# EAGLE design valiant_v1 (EAGLE 7.6.0)
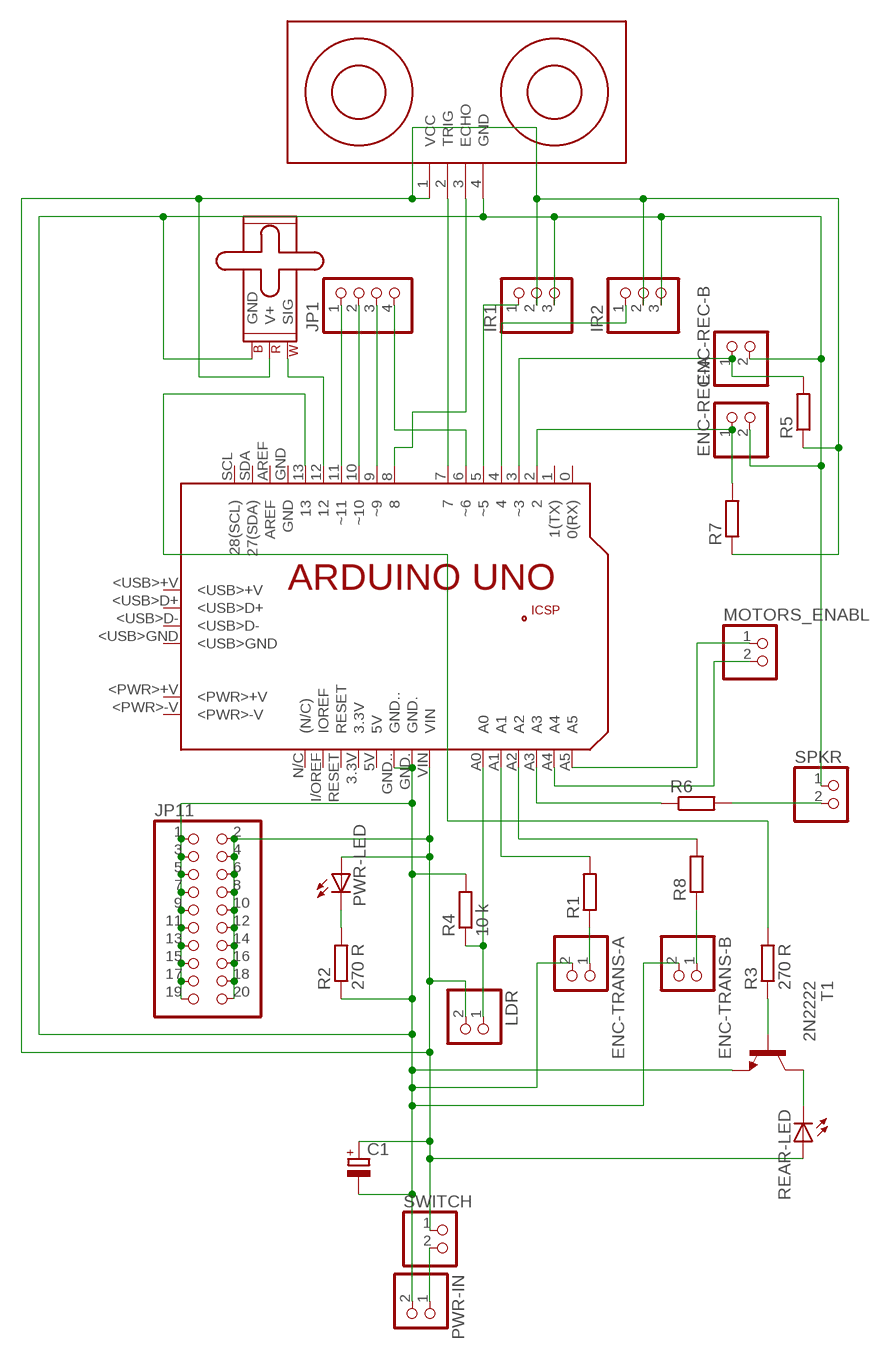
[diagram p0: schematic, sheet 1]

## Parts
C1  CPOL-EUE2,5-6E  [E2,5-6E]
ENC-REC-A  PINHD-1X2  [1X02]
ENC-REC-B  PINHD-1X2  [1X02]
ENC-TRANS-A  PINHD-1X2  [1X02]
ENC-TRANS-B  PINHD-1X2  [1X02]
IR1  PINHD-1X3  [1X03]
IR2  PINHD-1X3  [1X03]
JP1  PINHD-1X4  [1X04]
JP11  PINHD-2X10  [2X10]
LDR  PINHD-1X2  [1X02]
M1  SMALL_SERVO  [1X03]
MOTORS_ENABLE  PINHD-1X2  [1X02]
PCB1  ARDUINO_UNO  [ARDUINO_UNO]
PWR-IN  PINHD-1X2  [1X02]
PWR-LED  LED5MM  [LED5MM]
R1  R-EU_0204/7  [0204/7]
R2  270 R  R-EU_0204/7  [0204/7]
R3  270 R  R-EU_0204/7  [0204/7]
R4  10 k  R-EU_0204/7  [0204/7]
R5  R-EU_0204/7  [0204/7]
R6  R-EU_0204/7  [0204/7]
R7  R-EU_0204/7  [0204/7]
R8  R-EU_0204/7  [0204/7]
REAR-LED  LED5MM  [LED5MM]
SPKR  PINHD-1X2  [1X02]
SWITCH  PINHD-1X2  [1X02]
T1  2N2222  [TO92-EBC-OVAL]
U$1  ULTRASONIC-HC-SR04#V  [ULTRASONIC-HC-SR04#V]

## Nets
N$1: R3.1 T1.B
N$2: PCB1.7 U$1.2(TRIG)
N$3: JP1.4 PCB1.6(~6)
N$4: JP1.3 PCB1.9(~9)
N$5: JP1.2 PCB1.10(~10)
N$6: JP1.1 PCB1.11(~11)
N$7: PCB1.8 U$1.3(ECHO)
N$8: ENC-TRANS-A.1 R1.1
N$9: LDR.1 PCB1.A0 R4.1
N$10: PCB1.A1 R1.2
N$11: PCB1.A2 R8.2
N$12: PCB1.13 R3.2
N$13: ENC-REC-A.1 PCB1.2 R7.2
N$14: C1.+ IR1.2 IR2.2 JP11.2 JP11.4 JP11.6 JP11.8 JP11.10 JP11.12 JP11.14 JP11.16 JP11.18 JP11.20 LDR.2 M1.2(V+) PCB1.VIN PWR-LED.A R5.1 R7.1 REAR-LED.A SWITCH.1 U$1.1(VCC)
N$15: PWR-IN.1 SWITCH.2
N$16: ENC-TRANS-B.1 R8.1
N$17: PWR-LED.K(C) R2.2
N$18: M1.1(SIG) PCB1.12
N$19: REAR-LED.K(C) T1.C
N$20: MOTORS_ENABLE.2 PCB1.A4
N$21: IR1.1 PCB1.5(~5)
N$22: IR2.1 PCB1.4
N$23: ENC-REC-B.1 PCB1.3(~3) R5.2
N$24: R6.2 SPKR.2
N$25: PCB1.A3 R6.1
N$26: C1.- ENC-REC-A.2 ENC-REC-B.2 ENC-TRANS-A.2 ENC-TRANS-B.2 IR1.3 IR2.3 JP11.1 JP11.3 JP11.5 JP11.7 JP11.9 JP11.11 JP11.13 JP11.15 JP11.17 JP11.19 M1.3(GND) PCB1.GND. PCB1.GND.. PWR-IN.2 R2.1 R4.2 SPKR.1 T1.E U$1.4(GND)
N$27: MOTORS_ENABLE.1 PCB1.A5
Unconnected: PCB1.0(0(RX)) PCB1.1(1(TX)) PCB1.3.3V PCB1.5V PCB1.+5V PCB1.<PWR>+V PCB1.<PWR>-V PCB1.<USB>+V PCB1.<USB>D+ PCB1.<USB>D- PCB1.<USB>GND PCB1.AREF PCB1.GND PCB1.GND_ PCB1.I/OREF(IOREF) PCB1.MISO PCB1.MOSI PCB1.N/C((N/C)) PCB1.RESET PCB1.RESET. PCB1.SCK PCB1.SCL(28(SCL)) PCB1.SDA(27(SDA))

## Library data of the parts
C1 = resistor:CPOL-EU: POLARIZED CAPACITOR, European symbol
ENC-REC-A ENC-REC-B ENC-TRANS-A ENC-TRANS-B LDR MOTORS_ENABLE PWR-IN SPKR SWITCH = pinhead:PINHD-1X2: PIN HEADER
IR1 IR2 = pinhead:PINHD-1X3: PIN HEADER
JP1 = pinhead:PINHD-1X4: PIN HEADER
JP11 = pinhead:PINHD-2X10: PIN HEADER
M1 = SparkFun-Electromechanical:SMALL_SERVO: Small servo motor This is the small servo used in the SIK. SKU: ROB-09065
PCB1 = E14_Arduino_revB:ARDUINO_UNO: Device for representing an Arduino Uno board with a footprint in an EAGLE design. Created by Dave Young for Element14. More EAGLE documentation at: http://www.element14.com/community/community/knode/cadsoft_eagle
PWR-LED REAR-LED = adafruit:LED: LED OSRAM: - CHIPLED LG R971, LG N971, LY N971, LG Q971, LY Q971, LO R971, LY R971 LH N974, LH R974 LS Q976, LO Q976, LY Q976 LO Q996 - Hyper CHIPLED LW Q18S LB Q993, LB Q99A, LB R99A - SideLED LS A670, LO A670, LY A670, LG A670, LP A670 LB A673, LV A673, LT A673, LW A673 LH A674 LY A675 LS A676, LA A676, LO A676, LY A676, LW A676 LS A679, LY A679, LG A679 - Hyper Micro SIDELED® LS Y876, LA Y876, LO Y876, LY Y876 LT Y87S - SmartLED LW L88C, LW L88S LB L89C, LB L89S, LG L890 LS L89K, LO L89K, LY L89K LS L896, LA L896, LO L896, LY L896 - TOPLED LS T670, LO T670, LY T670, LG T670, LP T670 LSG T670, LSP T670, LSY T670, LOP T670, LYG T670 LG T671, LOG T671, LSG T671 LB T673, LV T673, LT T673, LW T673 LH T674 LS T676, LA T676, LO T676, LY T676, LB T676, LH T676, LSB T676, LW T676 LB T67C, LV T67C, LT T67C, LS T67K, LO T67K, LY T67K, LW E67C LS E67B, LA E67B, LO E67B, LY E67B, LB E67C, LV E67C, LT E67C LW T67C LS T679, LY T679, LG T679 LS T770, LO T770, LY T770, LG T770, LP T770 LB T773, LV T773, LT T773, LW T773 LH T774 LS E675, LA E675, LY E675, LS T675 LS T776, LA T776, LO T776, LY T776, LB T776 LHGB T686 LT T68C, LB T68C - Hyper Mini TOPLED® LB M676 - Mini TOPLED Santana® LG M470 LS M47K, LO M47K, LY M47K Source: http://www.osram.convergy.de/
R1-R8 = rcl:R-EU_: RESISTOR, European symbol
T1 = adafruit:2N2222: NPN TRANSISTOR Big oval pads
U$1 = diy-modules:ULTRASONIC-HC-SR04: Ultrasonic Ranging Module HC-SR04

## Board
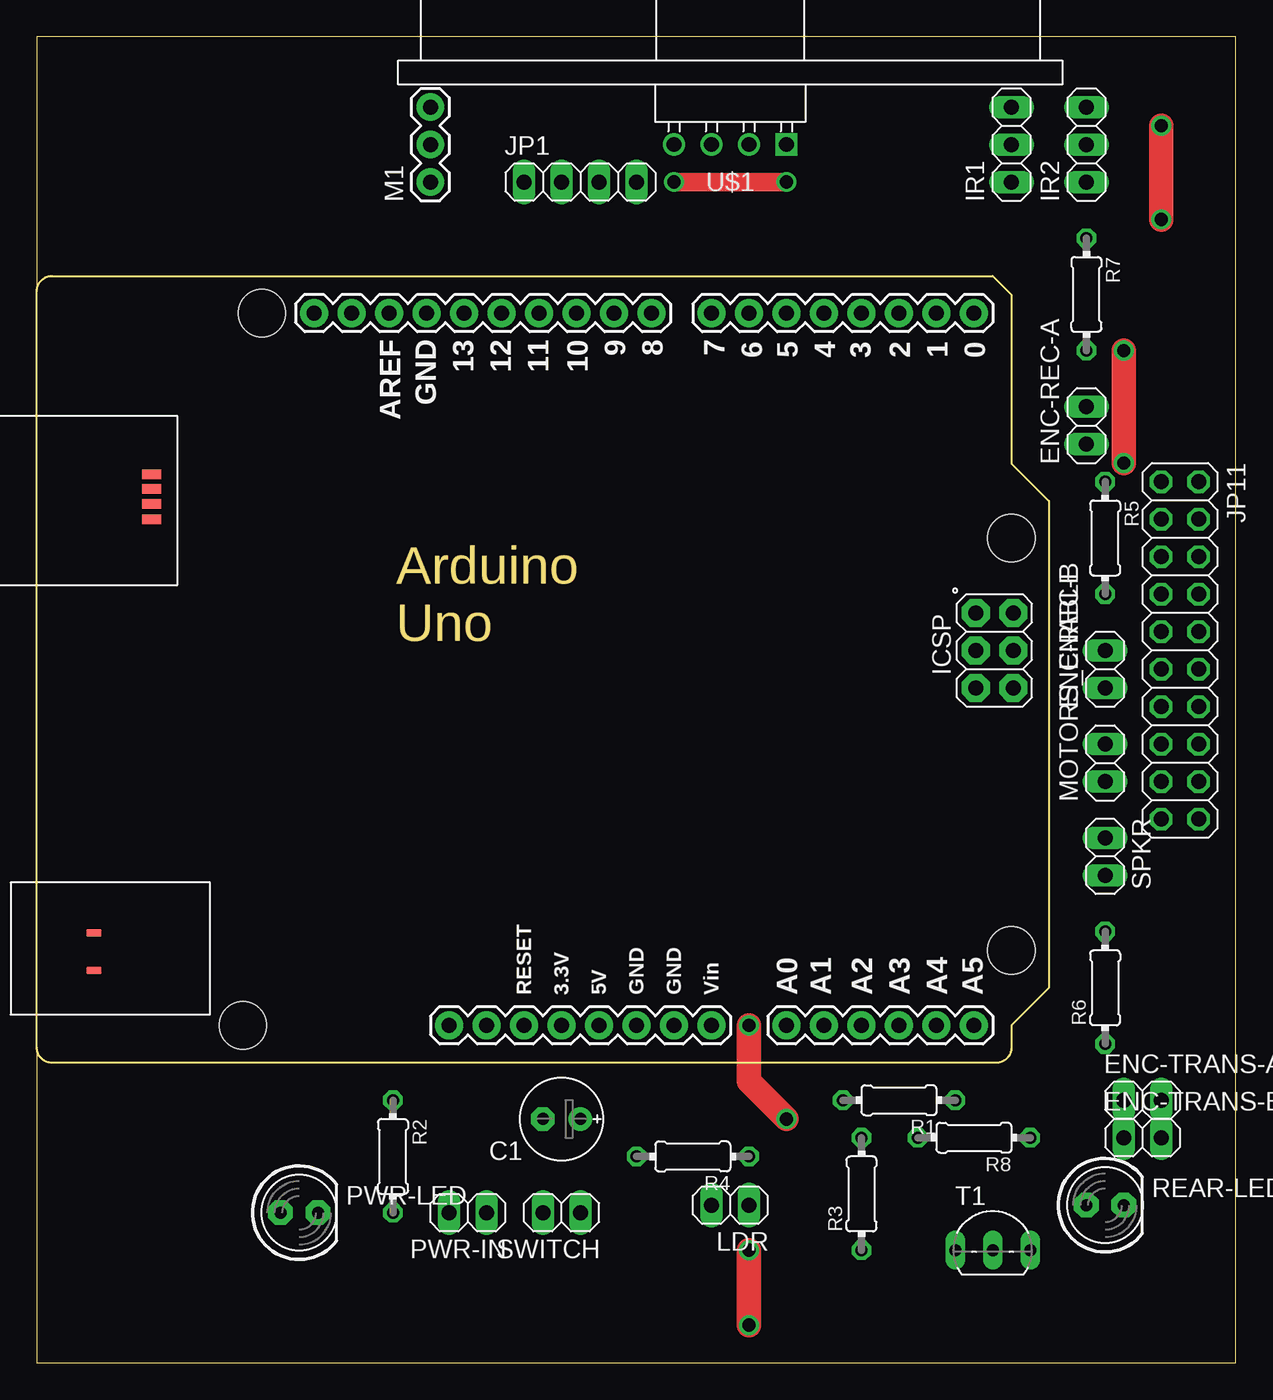
[diagram p1: board, top side]
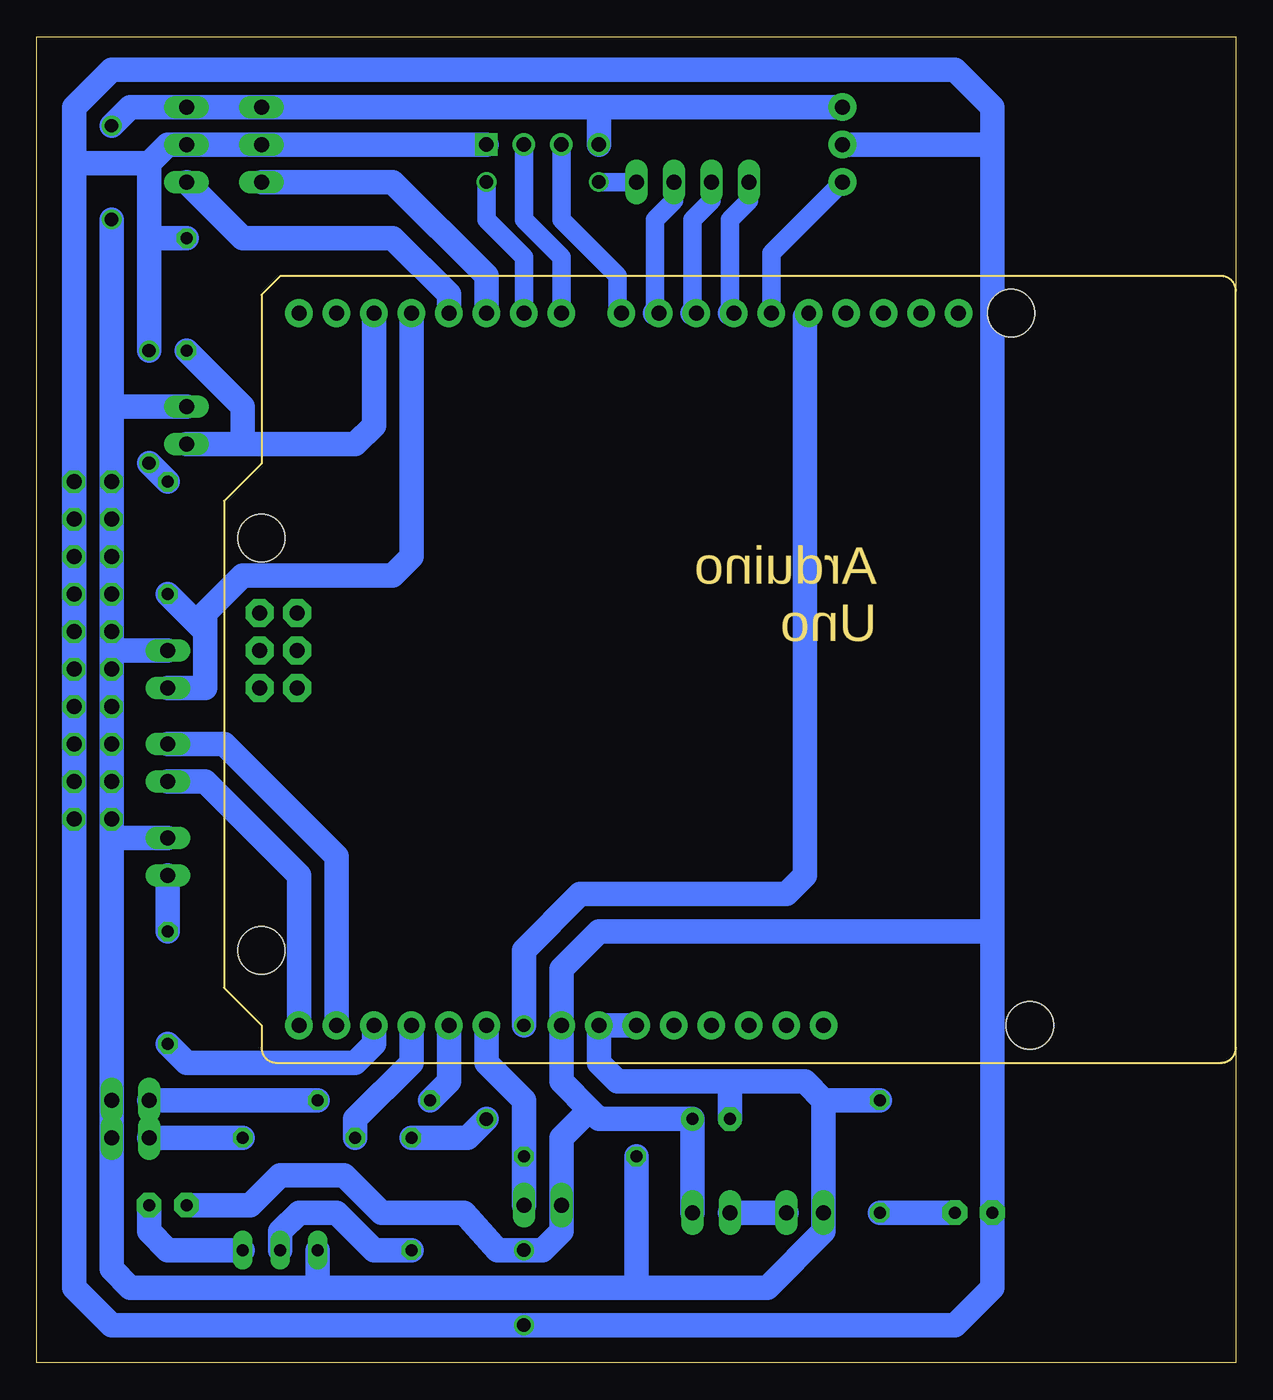
[diagram p2: board, bottom side, seen from below]

Size 81.26 x 89.84 mm. Coordinates in mm from the lower left corner, seen from the top.
Outline: 0,0 81.26,0 81.26,89.84 0,89.84 0,0
Copper layers (1*16): Top 0.035mm / dielectric 1.5mm / Bottom 0.035mm
Design rules "default *": minimum track width 10mil, minimum drill 24mil, track to track 8mil, track to pad 8mil, pad to pad 8mil, via to via 8mil, smd to smd 8mil, copper to edge 40mil, drill to drill 8mil, minimum pad ring 10mil, minimum via ring 8mil, stop-mask expansion 4mil, vias tented up to drill 0mil, thermal gap 10mil

### Footprints (pad centres in the part's own frame; a part is rotated, then mirrored left to right if it is on the bottom)
E2,5-6E = drill 0.813 pad 1.575: + -1.27,0 | drill 0.813 pad 1.575 octagon: - 1.27,0
1X02 = drill 1.016 long: 1 -1.27,0; 2 1.27,0
1X03 = drill 1.016 long: 1 -2.54,0; 2 0,0; 3 2.54,0
1X04 = drill 1.016 long: 1 -3.81,0; 2 -1.27,0; 3 1.27,0; 4 3.81,0
2X10 = drill 1.016 octagon: 1 -11.43,-1.27; 2 -11.43,1.27; 3 -8.89,-1.27; 4 -8.89,1.27; 5 -6.35,-1.27; 6 -6.35,1.27; 7 -3.81,-1.27; 8 -3.81,1.27; 9 -1.27,-1.27; 10 -1.27,1.27; 11 1.27,-1.27; 12 1.27,1.27; 13 3.81,-1.27; 14 3.81,1.27; 15 6.35,-1.27; 16 6.35,1.27; 17 8.89,-1.27; 18 8.89,1.27; 19 11.43,-1.27; 20 11.43,1.27
1X03' = drill 1.016 pad 1.88: 1 0,0; 2 2.54,0; 3 5.08,0
ARDUINO_UNO = drill 1.016 pad 1.88: 0 63.5,50.8; 1 60.96,50.8; 2 58.42,50.8; 3 55.88,50.8; 3.3V 35.56,2.54; 4 53.34,50.8; 5 50.8,50.8; 5V 38.1,2.54; 6 48.26,50.8; 7 45.72,50.8; 8 41.656,50.8; 9 39.116,50.8; 10 36.576,50.8; 11 34.036,50.8; 12 31.496,50.8; 13 28.956,50.8; A0 50.8,2.54; A1 53.34,2.54; A2 55.88,2.54; A3 58.42,2.54; A4 60.96,2.54; A5 63.5,2.54; AREF 23.876,50.8; GND 26.416,50.8; GND. 43.18,2.54; GND.. 40.64,2.54; I/OREF 30.48,2.54; N/C 27.94,2.54; RESET 33.02,2.54; SCL 18.796,50.8; SDA 21.336,50.8; VIN 45.72,2.54 | drill 1.016 pad 1.88 octagon: +5V 66.167,30.48; GND_ 66.167,25.4; MISO 63.627,30.48; MOSI 66.167,27.94; RESET. 63.627,25.4; SCK 63.627,27.94 | smd 1.016 x 0.508: <PWR>+V 3.861,8.814; <PWR>-V 3.861,6.274 | smd 1.27 x 0.635: <USB>+V 7.772,39.878; <USB>D+ 7.772,38.887; <USB>D- 7.772,37.871; <USB>GND 7.772,36.83 | hole 3.2: 66.04,7.62; 66.04,35.56; 15.24,50.8; 13.97,2.54
LED5MM = drill 0.813 pad 1.676 octagon: A -1.27,0; K 1.27,0
0204/7 = drill 0.813 octagon: 1 -3.81,0; 2 3.81,0
TO92-EBC-OVAL = drill 0.813 long: B 0,-1.27; C 2.54,-1.27; E -2.54,-1.27
ULTRASONIC-HC-SR04#V = drill 1 square: 1 -3.81,0 | drill 1: 2 -1.27,0; 3 1.27,0; 4 3.81,0

### Placement (x,y rotation side)
C1  35.56,16.51 180 top
ENC-REC-A  71.12,63.5 90 top
ENC-REC-B  72.39,46.99 90 top
ENC-TRANS-A  74.93,17.78 0 top
ENC-TRANS-B  74.93,15.24 0 top
IR1  66.04,82.55 90 top
IR2  71.12,82.55 90 top
JP1  36.83,80.01 0 top
JP11  77.47,48.26 270 top
LDR  46.99,10.67 180 top
M1  SMALL_SERVO  [1X03']  26.67,80.01 90 top
MOTORS_ENABLE  72.39,40.64 90 top
PCB1  0,20.32 0 top
PWR-IN  29.21,10.16 180 top
PWR-LED  17.78,10.16 0 top
R1  58.42,17.78 180 top
R2  24.13,13.97 270 top
R3  55.88,11.43 90 top
R4  44.45,13.97 180 top
R5  72.39,55.88 270 top
R6  72.39,25.4 90 top
R7  71.12,72.39 270 top
R8  63.5,15.24 180 top
REAR-LED  72.39,10.67 0 top
SPKR  72.39,34.29 270 top
SWITCH  35.56,10.16 180 top
T1  64.77,8.89 0 top
U$1  46.99,82.55 180 top

### Tracks (layer width: path | path; a pad name or v marks a point on that pad's centre or on a via)
N$1
  Bottom 1.676: T1.B 64.77,8.89 63.5,10.16 60.96,10.16 58.42,7.62 R3.1
N$2
  Bottom 1.27: U$1.2 48.26,77.47 45.72,74.93 PCB1.7
N$3  (via drill 0.9)
  Top 1.27: v43.18,80.01 v50.8,80.01
  Bottom 1.27: JP1.4 v43.18,80.01 | PCB1.6 48.26,74.93 50.8,77.47 v50.8,80.01
N$4
  Bottom 1.27: 39.37,71.12 39.37,77.47 38.1,78.74 JP1.3
  Bottom 1.676: 39.37,71.12 PCB1.9
N$5
  Bottom 1.27: 36.83,71.12 36.83,77.47 35.56,78.74 JP1.2
  Bottom 1.676: 36.83,71.12 PCB1.10
N$6
  Bottom 1.27: 34.29,71.12 34.29,77.47 33.02,78.74 JP1.1
  Bottom 1.676: 34.29,71.12 PCB1.11
N$7
  Bottom 1.27: U$1.3 45.72,77.47 41.91,73.66 41.91,71.37 PCB1.8
N$8
  Bottom 1.676: R1.1 ENC-TRANS-A.1
N$9
  Bottom 1.676: LDR.1 R4.1 48.26,17.78 50.8,20.32 PCB1.A0
N$10
  Bottom 1.676: R1.2 53.34,19.05 PCB1.A1
N$11
  Bottom 1.676: R8.2 59.69,16.51 55.88,20.32 PCB1.A2
N$12  (via drill 0.9)
  Top 1.676: v50.8,16.51 48.26,19.05 v48.26,22.86
  Bottom 1.676: R3.2 52.07,15.24 v50.8,16.51 | v48.26,22.86 48.26,27.94 44.45,31.75 30.48,31.75 29.21,33.02 29.21,70.87 PCB1.13
N$13
  Bottom 1.676: PCB1.2 58.42,63.5 59.69,62.23 67.31,62.23 | 67.31,62.23 ENC-REC-A.1 | R7.2 67.31,64.77 67.31,62.23
N$14  (via drill 0.9)
  Top 1.676: v73.66,60.96 v73.66,68.58 | v48.26,7.62 v48.26,2.54
  Bottom 1.676: 78.74,81.28 JP11.2 JP11.4 JP11.6 JP11.8 JP11.10 JP11.12 JP11.14 JP11.16 JP11.18 JP11.20 78.74,5.08 76.2,2.54 v48.26,2.54 19.05,2.54 16.51,5.08 PWR-LED.A 16.51,29.21 | 78.74,81.28 78.74,85.09 76.2,87.63 19.05,87.63 16.51,85.09 16.51,82.55 | 16.51,29.21 43.18,29.21 45.72,26.67 PCB1.VIN 45.72,19.05 43.81,17.14 | U$1.1 IR1.2 IR2.2 72.39,82.55 73.66,81.28 | R7.1 73.66,76.2 | 73.66,76.2 73.66,81.28 | R5.1 v73.66,60.96 | v73.66,68.58 73.66,76.2 | 43.81,17.14 43.18,16.51 C1.+ SWITCH.1 | 43.81,17.14 45.72,15.24 LDR.2 45.72,8.89 46.99,7.62 v48.26,7.62 50.04,7.62 52.32,10.16 57.91,10.16 60.45,12.7 64.77,12.7 66.8,10.67 REAR-LED.A | 73.66,81.28 78.74,81.28 | 16.51,29.21 16.51,82.55 | M1.2 16.51,82.55
N$15
  Bottom 1.676: SWITCH.2 PWR-IN.1
N$16
  Bottom 1.676: ENC-TRANS-B.1 R8.1
N$17
  Bottom 1.676: R2.2 PWR-LED.K
N$18
  Bottom 1.27: PCB1.12 31.5,75.18 M1.1
N$19
  Bottom 1.676: T1.C 72.39,7.62 73.66,8.89 REAR-LED.K
N$20
  Bottom 1.676: MOTORS_ENABLE.2 68.58,41.91 60.96,34.29 PCB1.A4
N$21
  Bottom 1.676: PCB1.5 50.8,73.66 57.15,80.01 IR1.1
N$22
  Bottom 1.676: PCB1.4 53.34,72.39 57.15,76.2 67.31,76.2 IR2.1
N$23
  Bottom 1.676: PCB1.3 55.88,54.61 57.15,53.34 67.31,53.34 69.85,50.8 69.85,49.53 | ENC-REC-B.1 69.85,45.72 69.85,49.53 | R5.2 69.85,49.53
N$24
  Bottom 1.676: R6.2 SPKR.2
N$25
  Bottom 1.676: R6.1 71.12,20.32 59.69,20.32 58.42,21.59 PCB1.A3
N$26  (via drill 0.9)
  Top 1.676: v76.2,77.47 v76.2,83.82
  Bottom 1.676: 76.2,48.26 JP11.11 JP11.13 JP11.15 JP11.17 JP11.19 76.2,35.56 | 76.2,48.26 JP11.9 JP11.7 JP11.5 JP11.3 JP11.1 76.2,64.77 | 43.18,85.09 U$1.4 | 76.2,35.56 ENC-TRANS-A.2 ENC-TRANS-B.2 76.2,6.35 74.93,5.08 62.23,5.08 | 76.2,64.77 v76.2,77.47 | 40.64,5.08 31.75,5.08 27.94,8.89 PWR-IN.2 27.94,17.78 | 40.64,5.08 62.23,5.08 | 34.29,19.05 41.91,19.05 43.18,20.32 PCB1.GND. PCB1.GND.. | 34.29,19.05 29.21,19.05 27.94,17.78 | 43.18,85.09 M1.3 | 43.18,85.09 IR1.3 IR2.3 74.93,85.09 v76.2,83.82 | ENC-REC-A.2 76.2,64.77 | R4.2 40.64,5.08 | C1.- 34.29,19.05 | T1.E 62.23,5.08 | R2.1 27.94,17.78 | SPKR.1 76.2,35.56 | ENC-REC-B.2 76.2,48.26
N$27
  Bottom 1.676: PCB1.A5 63.5,33.02 69.85,39.37 MOTORS_ENABLE.1